# EAGLE schematic SpiSlvWiring (EAGLE 7.6.0)
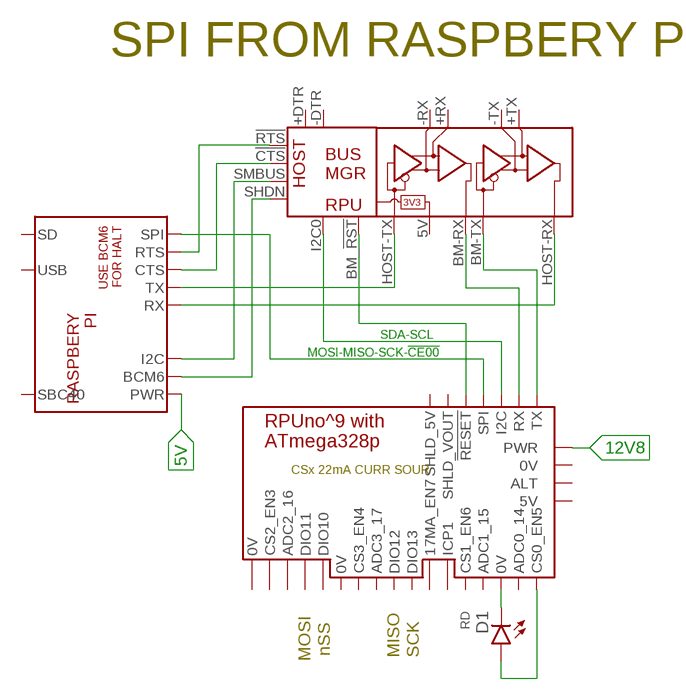
[diagram p0: schematic, sheet 1]

## Parts
BM1  RPUNO  [NA-30]
D1  RD  LED5MM  [LED5MM]
U$1  PI  [NA-30]
U$2  BUS_MGR  [WITH_RPU_NAMES]

## Nets
5V: U$1.12(PWR)
12V8: BM1.8(PWR)
MOSI-MISO-SCK-!CE00: BM1.4(SPI) U$1.10(SPI)
N$1: BM1.23(CS0_EN5) D1.A
N$2: BM1.26(0V) D1.K
N$3: U$1.1(CTS) U$2.!CTS
N$4: U$1.2(RTS) U$2.!RTS
N$5: BM1.2(RX) U$2.BM-RX(BM_RX)
N$6: U$1.3(RX) U$2.HOST-RX(HOST_RX)
N$7: U$1.4(TX) U$2.HOST-TX(HOST_TX)
N$8: BM1.1(TX) U$2.BM-TX(BM_TX)
N$9: U$1.8(I2C) U$2.SMBUS
N$10: U$1.7(BCM6) U$2.SHDN
SDA-SCL: BM1.3(I2C) U$2.I2C0
THRU-74LVC07: BM1.5(!RESET) U$2.BM_!RST!(BM-!RST!)
Unconnected: BM1.6(SHLD_5V) BM1.7(SHLD_VOUT) BM1.9(0V) BM1.10(ADC1_15) BM1.11(ADC0_14) BM1.12(ICP1) BM1.13(ADC2_16) BM1.14(DIO11) BM1.15(DIO10) BM1.16(ADC3_17) BM1.17(DIO12) BM1.18(DIO13) BM1.19(5V) BM1.20(ALT) BM1.21(17MA_EN7) BM1.22(CS1_EN6) BM1.24(CS2_EN3) BM1.27(0V) BM1.28(0V) BM1.29(CS3_EN4) U$1.5(SBC40) U$1.9(SD) U$1.11(USB) U$2.5V(PWR) U$2.+DTR U$2.+RX U$2.+TX U$2.-DTR U$2.-RX U$2.-TX

## Notes on the sheet
- SPI FROM RASPBERY PI
- nSS | MISO | SCK
- MOSI

## Library data of the parts
BM1 = Documentation:RPUNO: BM /w 328p
D1 = D-LED:LED: LED 120120WH [CREE,XHGAWT-00-0000-00000HXE1] LED WHITE 6500K 150LUM-W120120
U$1 = Documentation:PI: Raspbery Pi
U$2 = Documentation:BUS_MGR: RPU BUS MANAGER